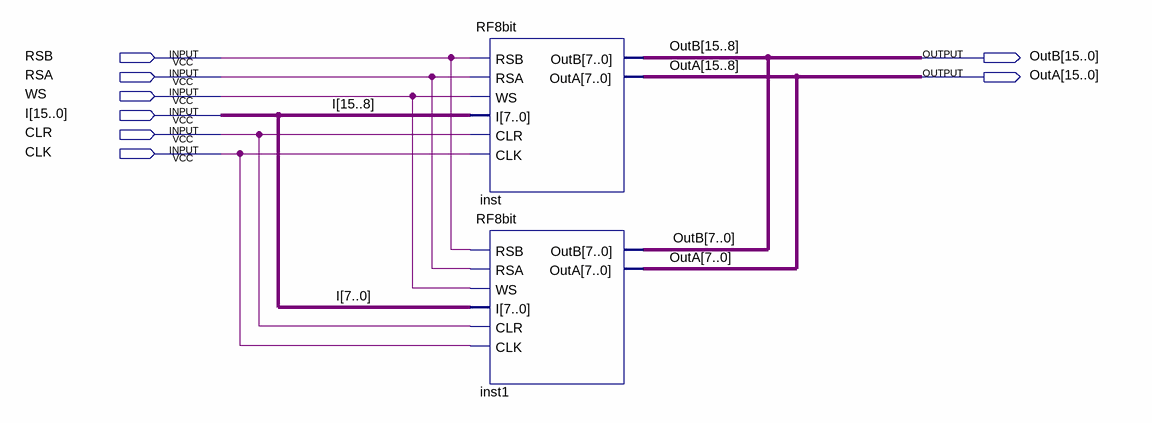
[diagram p0: schematic sheet]
// Quartus schematic RF16bit.bdf as structural Verilog: 2 symbols, 8 pins
module RF16bit (
  input  RSB,
  input  RSA,
  input  WS,
  input  [15:0] I,
  input  CLR,
  input  CLK,
  output [15:0] OutB,
  output [15:0] OutA
);

  RF8bit inst (.RSB(RSB), .RSA(RSA), .WS(WS), .I(I[15:8]), .CLR(CLR), .CLK(CLK), .OutB(OutB[15:8]), .OutA(OutA[15:8]));
  RF8bit inst1 (.RSB(RSB), .RSA(RSA), .WS(WS), .I(I[7:0]), .CLR(CLR), .CLK(CLK), .OutB(OutB[7:0]), .OutA(OutA[7:0]));
endmodule
